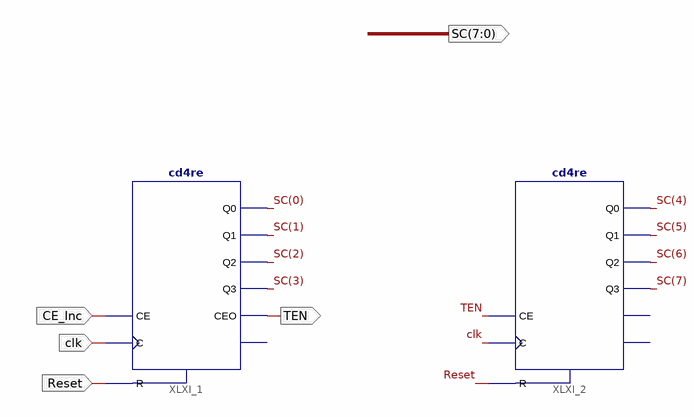
[diagram p0: schematic sheet 1]
// Xilinx ISE schematic Score.sch (spartan3e) as structural Verilog: 2 symbols, 5 ports
module Score (
  input  Reset,
  input  clk,
  input  CE_Inc,
  output TEN,
  output [7:0] SC
);

  cd4re XLXI_1 (
    .C(clk), .CE(CE_Inc), .R(Reset), .CEO(TEN), .Q0(SC[0]), .Q1(SC[1]), .Q2(SC[2]), .Q3(SC[3]));  // open: TC
  cd4re XLXI_2 (.C(clk), .CE(TEN), .R(Reset), .Q0(SC[4]), .Q1(SC[5]), .Q2(SC[6]), .Q3(SC[7]));  // open: CEO, TC
endmodule
